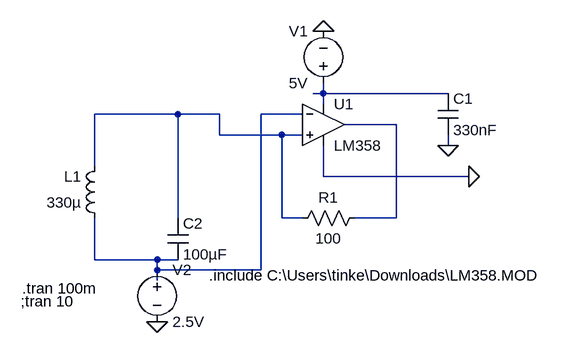
[diagram p0: schematic minedetector.asc]
minedetector.asc, the LTspice schematic file:
Version 4
SHEET 1 1720 680
WIRE 128 112 128 96
WIRE 128 112 112 112
WIRE 320 112 128 112
WIRE 128 128 128 112
WIRE -96 144 -224 144
WIRE -32 144 -96 144
WIRE 96 144 32 144
WIRE 240 160 160 160
WIRE -32 176 -32 144
WIRE 64 176 -32 176
WIRE 96 176 64 176
WIRE 320 192 320 176
WIRE -224 224 -224 144
WIRE 128 240 128 192
WIRE 352 240 128 240
WIRE -96 304 -96 144
WIRE 64 304 64 176
WIRE 96 304 64 304
WIRE 240 304 240 160
WIRE 240 304 176 304
WIRE -224 368 -224 304
WIRE -128 368 -224 368
WIRE -96 368 -128 368
WIRE -128 384 -128 368
WIRE 32 384 32 144
WIRE 32 384 -128 384
WIRE -128 400 -128 384
FLAG 128 16 0
FLAG 320 192 0
FLAG -128 464 0
FLAG 352 240 0
SYMBOL OpAmps\\opamp2 128 96 R0
SYMATTR InstName U1
SYMATTR Value LM358
SYMATTR SpiceModel LM358
SYMBOL cap -112 304 R0
SYMATTR InstName C2
SYMATTR Value 100µF
SYMBOL ind -208 320 R180
WINDOW 0 36 80 Left 2
WINDOW 3 36 40 Left 2
SYMATTR InstName L1
SYMATTR Value 330µ
SYMBOL res 192 288 R90
WINDOW 0 0 56 VBottom 2
WINDOW 3 32 56 VTop 2
SYMATTR InstName R1
SYMATTR Value 100
SYMBOL voltage 128 112 R180
WINDOW 0 24 96 Left 2
WINDOW 3 24 16 Left 2
WINDOW 123 0 0 Left 0
WINDOW 39 0 0 Left 0
SYMATTR InstName V1
SYMATTR Value 5V
SYMBOL cap 304 112 R0
SYMATTR InstName C1
SYMATTR Value 330nF
SYMBOL voltage -128 368 R0
WINDOW 123 0 0 Left 0
WINDOW 39 0 0 Left 0
SYMATTR InstName V2
SYMATTR Value 2.5V
TEXT -48 392 Left 2 !.include C:\\Users\\tinke\\Downloads\\LM358.MOD
TEXT -336 412 Left 2 !.tran 100m
TEXT -338 432 Left 2 !;tran 10

The netlist it stands for:
* minedetector.asc
XU1 N002 N003 N001 0 N004 LM358 LM358  ; pins In+ In- V+ V- OUT
C2 N002 N003 100µF
L1 N003 N002 330µ
R1 N004 N002 100
V1 N001 0 5V
C1 N001 0 330nF
V2 N003 0 2.5V
.include C:\Users\tinke\Downloads\LM358.MOD
.tran 100m
;tran 10
.backanno
.end